# Altium project wether_PCB_new.PrjPcb
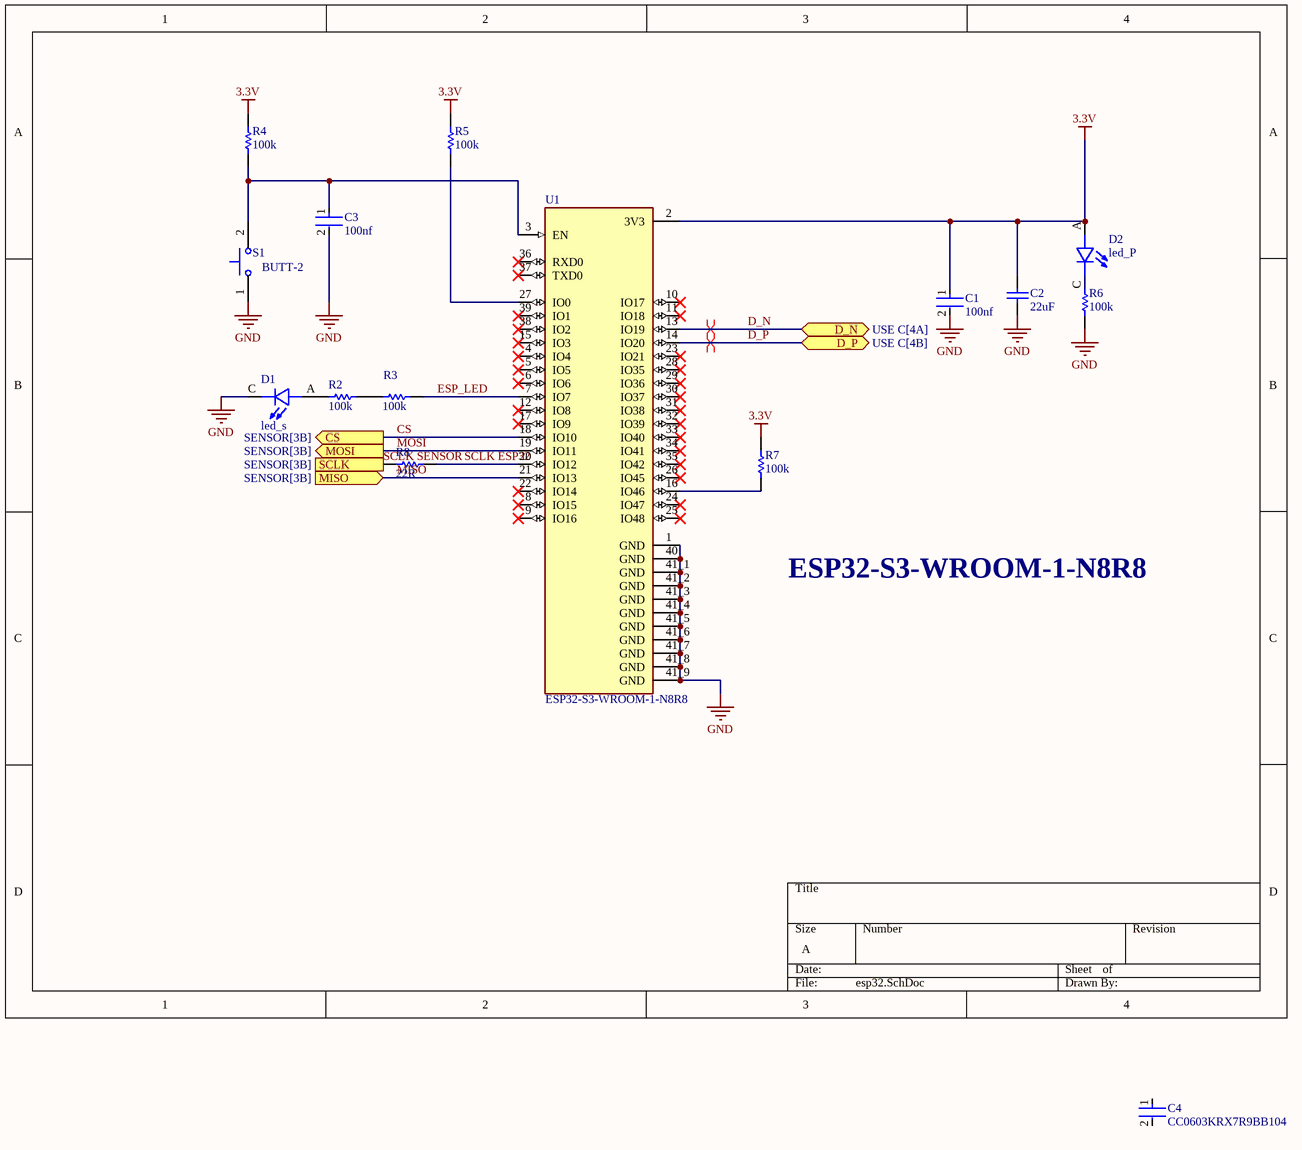
[diagram p0: esp32.SchDoc]
3 sheets, 29 parts. Net scope: flat (ports and power ports of the same name join across sheets).
Board file: wather_project_PCB.PcbDoc
Sheets:
  esp32.SchDoc
  USE C.SchDoc
  SENSOR.SchDoc

## Sheet esp32.SchDoc
size A; SheetNumber: 1; SheetTotal: 3

### Parts
C1  100nf  [FP-CC0603-DA-MFG]
C2  22uF  [CAPC3216X180X55ML20T25]
C3  100nf  [FP-CC0603-DA-MFG]
C4  CC0603KRX7R9BB104  [FP-CC0603-DA-MFG]
D1  led_s  [LEDRD254W57D500H1070]
D2  led_P  [LEDRD254W57D500H1070]
R2  100k  [RESC1005X40X25NL05T10]
R3  100k  [RESC1005X40X25NL05T10]
R4  100k  [RESC1005X40X25NL05T10]
R5  100k  [RESC1005X40X25NL05T10]
R6  100k  [RESC1005X40X25NL05T10]
R7  100k  [RESC1005X40X25NL05T10]
R8  22R  [RESC1608X55X25NL10T15]
S1  BUTT-2  [SW_BUTT-2]
U1  ESP32-S3-WROOM-1-N8R8  [XCVR_ESP32S3WROOM1N8R8]

### Ports
CS (out, see SENSOR[3B]), D_N (bidir, see USE C[4A]), D_P (bidir, see USE C[4B]), MISO (in, see SENSOR[3B]), MOSI (out, see SENSOR[3B]), SCLK (out, see SENSOR[3B])

### Nets
3.3V: C1.1 C2.2 D2.A R4.2 R5.2 R7.2 U1.2(3V3)
GND: C1.2 C2.1 C3.2 D1.C R6.1 S1.1 U1.1(GND) U1.40(GND) U1.41_1(GND) U1.41_2(GND) U1.41_3(GND) U1.41_4(GND) U1.41_5(GND) U1.41_6(GND) U1.41_7(GND) U1.41_8(GND) U1.41_9(GND)
CS: U1.18(IO10) ; port CS
D_N: U1.13(IO19) ; port D_N
D_P: U1.14(IO20) ; port D_P
ESP_LED: R3.1 U1.7(IO7)
MISO: U1.21(IO13) ; port MISO
MOSI: U1.19(IO11) ; port MOSI
SCLK ESP32: R8.2 U1.20(IO12)
SCLK SENSOR: R8.1 ; port SCLK
NetC3_1: C3.1 R4.1 S1.2 U1.3(EN)
NetD1_A: D1.A R2.2
NetD2_C: D2.C R6.2
NetR2_1: R2.1 R3.2
NetR5_1: R5.1 U1.27(IO0)
NetR7_1: R7.1 U1.16(IO46)

Not connected (* = marked no-connect by the designer): C4 1 2; U1 4(IO4)* 5(IO5)* 6(IO6)* 8(IO15)* 9(IO16)* 10(IO17)* 11(IO18)* 12(IO8)* 15(IO3)* 17(IO9)* 22(IO14)* 23(IO21)* 24(IO47)* 25(IO48)* 26(IO45)* 28(IO35)* 29(IO36)* 30(IO37)* 31(IO38)* 32(IO39)* 33(IO40)* 34(IO41)* 35(IO42)* 36(RXD0)* 37(TXD0)* 38(IO2)* 39(IO1)*

### Layout directives
differential pair: D_N, D_P

### Notes on the sheet
- ESP32-S3-WROOM-1-N8R8

### Library data of the parts
C1 C3 = CMP-2100-03601-2: CAP CER 0.1UF 50V X7R 0603; Manufacturer: YAGEO; Manufacturer Part Number: CC0603KRX7R9BB104; Material: Ceramic; Temperature Coefficient: 15%; Tolerance: 0.1; Height: 0.9mm; Voltage: 50 V; ComponentLink2Description: Datasheet; Device Class L2: Capacitors; Temperature Range High: +125°C; Category: Cap; Capacitance: 100 nF; Footprint Url: http://www.yageo.com/exep/pages/download/literatures/UPY-C_GEN_24.pdf; ComponentLink2URL: http://www.yageo.com/documents/recent/UPY-GPHC_X7R_6.3V-to-50V_18.pdf; Package: CC0603-DA; Temperature: -55°C to +125°C; Voltage Rating: 50 V; Temperature Characteristic: X7R; Device Class L1: Passive Components; Temperature Range Low: -55°C; RoHS: TRUE; Automotive: No; Value: 100 nF; Device Class L3: Ceramic Capacitors; Octopart: https://octopart.com/cc0603krx7r9bb104-yageo-42244635; Mouser Description: Multilayer Ceramic Capacitor, CC Series, 0.1 - F, - 10%, X7R, 50 V, 0603 [1608 Metric]; Lead Free: Yes; Digikey Description: CAP CER 0.1UF 50V X7R 0603
C2 = CMP-1662-00010-2: Chip Capacitor, 22 uF, +/- 10%, 25 V, -55 to 85 degC, 1206 (3216 Metric), RoHS, Tape and Reel; PartNumber: GRM31CR61E226KE15L; Voltage Rating: 25 V; Type (Capacitors): X5R; Case\/Package: 1206; PackageDescription: 2-Pin Surface Mount Device, Body 3.2 x 1.6 mm; ComponentLink1URL: http://www.murata.com/; Mount: Surface Mount; Capacitance: 22 uF; PackageReference: 1206; ComponentLink2Description: Datasheet; ComponentLink1Description: Manufacturer URL; Min Operating Temperature: -55 degC; RoHSCompliant: true; Radiation Hardening: No; Package Quantity: 2000; Length: 3.2 mm; Height: 1.6 mm; ComponentLink2URL: http://search.murata.co.jp/Ceramy/image/img/A01X/G101/ENG/GRM31CR61E226KE15-01.pdf; Width: 1.6 mm; Case Code (Imperial): 1206; Max Operating Temperature: 85 degC; Mounting Technology: Surface Mount; Tolerance: 10%; Voltage Rating (DC): 25 V; Pins: 2; Packaging: Tape and Reel; DatasheetVersion: 03/2016; Case Code (Metric): 3216; REACH SVHC: No SVHC
C4 = CMP-2100-03601-2: CAP CER 0.1UF 50V X7R 0603; Manufacturer: YAGEO; Material: Ceramic; Capacitance: 100 nF; Temperature Coefficient: 15%; Tolerance: 0.1; Value: 100 nF; Height: 0.9mm; Voltage: 50 V; ComponentLink2Description: Datasheet; Device Class L2: Capacitors; Temperature Range High: +125°C; Category: Cap; Footprint Url: http://www.yageo.com/exep/pages/download/literatures/UPY-C_GEN_24.pdf; ComponentLink2URL: http://www.yageo.com/documents/recent/UPY-GPHC_X7R_6.3V-to-50V_18.pdf; Package: CC0603-DA; Temperature: -55°C to +125°C; Voltage Rating: 50 V; Temperature Characteristic: X7R; Device Class L1: Passive Components; Temperature Range Low: -55°C; Manufacturer Part Number: CC0603KRX7R9BB104; RoHS: TRUE; Automotive: No; Device Class L3: Ceramic Capacitors; Octopart: https://octopart.com/cc0603krx7r9bb104-yageo-42244635; Mouser Description: Multilayer Ceramic Capacitor, CC Series, 0.1 - F, - 10%, X7R, 50 V, 0603 [1608 Metric]; Lead Free: Yes; Digikey Description: CAP CER 0.1UF 50V X7R 0603
D1 D2 = L08R5000Q1: LED, 5MM, ORANGE; LED / Lamp Size: 5mm / T-1 3/4; LED Colour: Orange; Typ Luminous Intensity: 4.3mcd; Viewing Angle: ...; MF: LED Technology; Value: *; SnapEDA_Link: https://www.snapeda.com/parts/L08R5000Q1/LED+Technology/view-part/?ref=snap; MP: L08R5000Q1; Check_prices: https://www.snapeda.com/parts/L08R5000Q1/LED+Technology/view-part/?ref=eda; Availability: In Stock; Price: None; Package: None
R2-R7 = CMP-2002-07343-1: Part Number: RC0402FR-07100KL; Manufacturer: Yageo / Phycomp
R8 = CMP-1659-00033-1: Chip Resistor, 22 Ohm, +/- 1%, 0.1 W, -55 to 155 degC, 0603 (1608 Metric), RoHS, Tape and Reel; Max Ouput Current: 8 A; Case\Package: SIP; Max Input Voltage: 1.4 V; ComponentLink2URL: http://www.yageo.com/documents/recent/PYu-RC_Group_51_RoHS_L_04.pdf; RoHSCompliant: true; Max Operating Temperature: 100 degC; PackageDescription: 2-Pin Surface Mount Device, Body 1.6 x 0.8 mm; ComponentLink1Description: Manufacturer URL; ComponentLink1URL: http://www.yageo.com/; Length: 18.5 mm; REACH SVHC: Unknown; Pins: 4; DatasheetVersion: Rev. 4, 02/2016; PackageReference: 0603; Output Current: 8 A; Min Operating Temperature: -25 degC; Height: 19.6 mm; Mount: Through Hole; Radiation Hardening: No; ComponentLink2Description: Datasheet; Package Quantity: 200; Packaging: Rail/Tube
S1 = BUTT-2: Tactile Switches MINI PUSH BUTTON SWITCH 2-PIN QTY. 4; MF: Gravitech; SnapEDA_Link: https://www.snapeda.com/parts/BUTT-2/Gravitech/view-part/?ref=snap; Package: None; Value: *; MP: BUTT-2; Check_prices: https://www.snapeda.com/parts/BUTT-2/Gravitech/view-part/?ref=eda
U1 = ESP32-S3-WROOM-1-N8R8: Bluetooth, WiFi 802.11b/g/n, Bluetooth v5.0 Transceiver Module 2.4GHz PCB Trace Surface Mount; MF: Espressif Systems; Package: None; Price: None; Check_prices: https://www.snapeda.com/parts/ESP32-S3-WROOM-1-N8R8/Espressif+Systems/view-part/?ref=eda; Value: *; SnapEDA_Link: https://www.snapeda.com/parts/ESP32-S3-WROOM-1-N8R8/Espressif+Systems/view-part/?ref=snap; MP: ESP32-S3-WROOM-1-N8R8; Availability: In Stock; Purchase-URL: https://pricing.snapeda.com/search?q=ESP32-S3-WROOM-1-N8R8&ref=eda

## Sheet USE C.SchDoc
size A; SheetNumber: 2; SheetTotal: 3
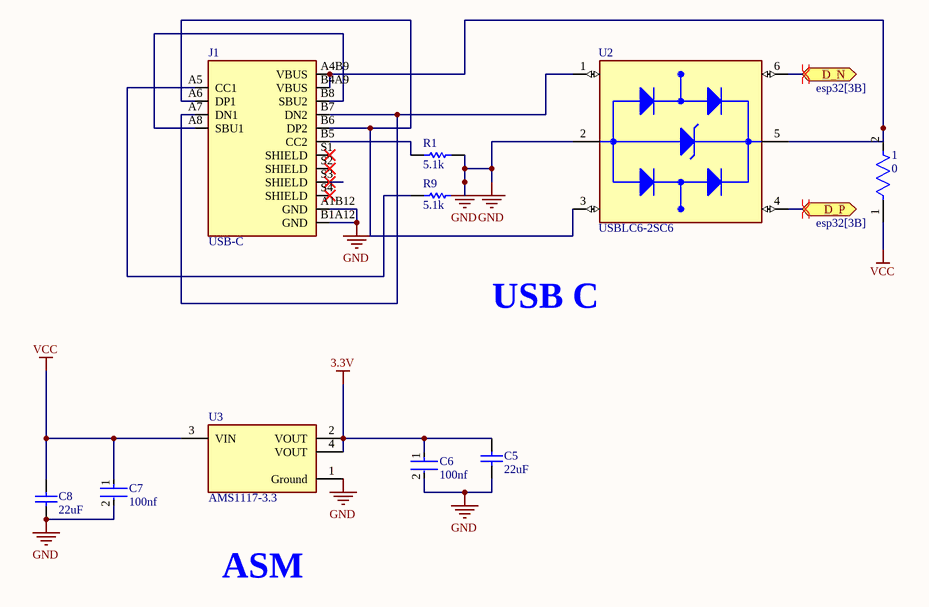
[diagram p1: USE C.SchDoc]

### Parts
1  0  [FP-RC0402-0_4-IPC_A]
C5  22uF  [CAPC3216X180X55ML20T25]
C6  100nf  [FP-CC0603-DA-MFG]
C7  100nf  [FP-CC0603-DA-MFG]
C8  22uF  [CAPC3216X180X55ML20T25]
J1  USB-C  [HRO_TYPE-C-31-M-12]
R1  5.1k  [RESC1005X40X25NL05T10]
R9  5.1k  [RESC1005X40X25NL05T10]
U2  USBLC6-2SC6  [SOT95P280X145-6N]
U3  AMS1117-3.3  [FP-AMS1117-IPC_C]

### Ports
D_N (bidir, see esp32[3B]), D_P (bidir, see esp32[3B])

### Nets
3.3V: C5.2 C6.1 U3.2(VOUT) U3.4(VOUT)
GND: C5.1 C6.2 C7.2 C8.1 J1.A1B12(GND) J1.B1A12(GND) R1.2 R9.2 U2.2(GND) U3.1(Ground)
VCC: 1.1 C7.1 C8.2 U3.3(VIN)
D_N: U2.6(I/O1_OUT) ; port D_N
D_P: U2.4(I/O2_OUT) ; port D_P
Net1_2: 1.2 J1.A4B9(VBUS) J1.B4A9(VBUS) U2.5(VBUS)
NetJ1_A5: J1.A5(CC1) R9.1
NetJ1_A6: J1.A6(DP1) J1.B6(DP2) U2.3(I/O2_IN)
NetJ1_A7: J1.A7(DN1) J1.B7(DN2) U2.1(I/O1_IN)
NetJ1_A8: J1.A8(SBU1) J1.B8(SBU2)
NetJ1_B5: J1.B5(CC2) R1.1

Not connected (* = marked no-connect by the designer): J1 S1(SHIELD)* S2(SHIELD)* S3(SHIELD)* S4(SHIELD)*

### Layout directives
differential pair: D_N, D_P

### Notes on the sheet
- USB C
- ASM

### Library data of the parts
1 = CMP-2002-07342-2: RES SMD 0 OHM JUMPER 1/16W 0402; Resistance: 0R; Temperature Coefficient: 200ppm/°C; Tolerance: 1%; Power Rating: 62.5mW; Voltage Rating: 50V; Max Power Dissipation: 63mW; Features: Moisture Resistant; Length: 1mm; Case Code (Metric): 1005; Series: RC; RoHS Compliant: Yes; Resistor Type: Thick Film; Height: 0.35mm; Min Operating Temperature: -55°C; Case Code (Imperial): 0402; Number of Terminations: 2; Contact Plating: Tin; Case/Package: 0402; Size Code: 0402; Termination: SMD/SMT; Max Operating Temperature: 155°C; Width: 0.5mm; Mount: Surface Mount; Lead Free: Lead Free; Packaging: Tape and Reel; Radiation Hardening: No
C5 C8 = CMP-1662-00010-2: as C2 on sheet esp32; PackageDescription: 2-Pin Surface Mount Device, Body 3.2 x 1.6 mm; ComponentLink1URL: http://www.murata.com/; Mount: Surface Mount; Capacitance: 22 uF; PackageReference: 1206; ComponentLink2Description: Datasheet; ComponentLink1Description: Manufacturer URL; Min Operating Temperature: -55 degC; RoHSCompliant: true; Radiation Hardening: No; Package Quantity: 2000; Length: 3.2 mm; Height: 1.6 mm; ComponentLink2URL: http://search.murata.co.jp/Ceramy/image/img/A01X/G101/ENG/GRM31CR61E226KE15-01.pdf; Width: 1.6 mm; Case Code (Imperial): 1206; Max Operating Temperature: 85 degC; Mounting Technology: Surface Mount; Tolerance: 10%; Voltage Rating (DC): 25 V; Pins: 2; Packaging: Tape and Reel; DatasheetVersion: 03/2016; Case Code (Metric): 3216; REACH SVHC: No SVHC
C6 C7 = CMP-2100-03601-2: as C1 on sheet esp32; Height: 0.9mm; Voltage: 50 V; ComponentLink2Description: Datasheet; Device Class L2: Capacitors; Temperature Range High: +125°C; Category: Cap; Capacitance: 100 nF; Footprint Url: http://www.yageo.com/exep/pages/download/literatures/UPY-C_GEN_24.pdf; ComponentLink2URL: http://www.yageo.com/documents/recent/UPY-GPHC_X7R_6.3V-to-50V_18.pdf; Package: CC0603-DA; Temperature: -55°C to +125°C; Voltage Rating: 50 V; Temperature Characteristic: X7R; Device Class L1: Passive Components; Temperature Range Low: -55°C; RoHS: TRUE; Automotive: No; Value: 100 nF; Device Class L3: Ceramic Capacitors; Octopart: https://octopart.com/cc0603krx7r9bb104-yageo-42244635; Mouser Description: Multilayer Ceramic Capacitor, CC Series, 0.1 - F, - 10%, X7R, 50 V, 0603 [1608 Metric]; Lead Free: Yes; Digikey Description: CAP CER 0.1UF 50V X7R 0603
J1 = USB-C: USB-C (USB TYPE-C) USB 3.2 Gen 2 (USB 3.1 Gen 2, Superspeed + (USB 3.1)) Receptacle Connector 24 Position Surface Mount, Through Hole; MF: Adam Technologies; SnapEDA_Link: https://www.snapeda.com/parts/USB-C/Adam+Tech/view-part/?ref=snap; Package: None; Value: *; MP: USB-C; Check_prices: https://www.snapeda.com/parts/USB-C/Adam+Tech/view-part/?ref=eda
R1 R9 = CMP-2002-07753-1: Part Number: RC0402FR-075K1L; Manufacturer: Yageo / Phycomp
U2 = USBLC6-2SC6: 17V Clamp 5A (8/20Âµs) Ipp Tvs Diode Surface Mount SOT-23-6; MF: STMicroelectronics; Value: *; SnapEDA_Link: https://www.snapeda.com/parts/USBLC6-2SC6/STMicroelectronics/view-part/?ref=snap; Check_prices: https://www.snapeda.com/parts/USBLC6-2SC6/STMicroelectronics/view-part/?ref=eda; Purchase-URL: https://pricing.snapeda.com/search/part/USBLC6-2SC6/?ref=eda; Price: None; Availability: In Stock; Package: SOT-23-6 STMicroelectronics; MP: USBLC6-2SC6
U3 = CMP-209535-000001-1: LDO Voltage Regulators 1A, 3.3V; Manufacturer: Advanced Monolithic Systems; Dropout Voltage: 1.1V; Output Type: Fixed; Nominal Supply Current: 5mA; Max Power Dissipation: 1.2W; Max Supply Voltage: 15V; Number Of Outputs: 1; Standoff Height: 0.64mm; Max Junction Temp: +125°C; Height: 1.8mm; Package: AMS1117; Device Class L2: Power Management ICs; ComponentLink2Description: Datasheet; ComponentLink2URL: http://www.advanced-monolithic.com/pdf/ds1117.pdf; Category: IC; RoHS: TRUE; Automotive: No; Device Class L1: Integrated Circuits (ICs); Output Current: 1A; Device Class L3: Voltage Regulators - Linear; Temperature: -40°C to +125°C; Output Voltage: 3.3V; Manufacturer Part Number: AMS1117-3.3; Temperature Range Low: -40°C; Octopart: https://octopart.com/ams1117-3.3-advanced+monolithic+systems-25899300; Lead Free: Yes; Ipc Land Pattern Name: SOT229P700X180-4; Temperature Range High: +125°C

## Sheet SENSOR.SchDoc
size A; SheetNumber: 3; SheetTotal: 3
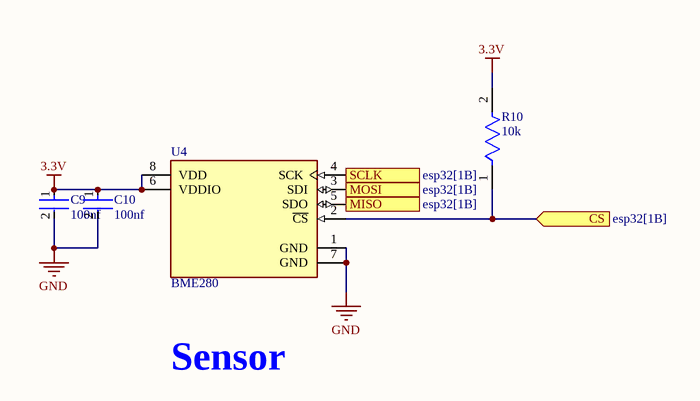
[diagram p2: SENSOR.SchDoc]

### Parts
C9  100nf  [FP-CC0603-DA-MFG]
C10  100nf  [FP-CC0603-DA-MFG]
R10  10k  [FP-RC0603-0_55-IPC_C]
U4  BME280  [FP-BME280-MFG]

### Ports
CS (in, see esp32[1B]), MISO (out, see esp32[1B]), MOSI (in, see esp32[1B]), SCLK (in, see esp32[1B])

### Nets
3.3V: C9.1 C10.1 R10.2 U4.6(VDDIO) U4.8(VDD)
GND: C9.2 C10.2 U4.1(GND) U4.7(GND)
CS: R10.1 U4.2(~{CS}) ; port CS
MISO: U4.5(SDO) ; port MISO
MOSI: U4.3(SDI) ; port MOSI
SCLK SENSOR: U4.4(SCK) ; port SCLK

### Notes on the sheet
- Sensor

### Library data of the parts
C9 C10 = CMP-2100-03601-2: as C1 on sheet esp32; Height: 0.9mm; Voltage: 50 V; ComponentLink2Description: Datasheet; Device Class L2: Capacitors; Temperature Range High: +125°C; Category: Cap; Capacitance: 100 nF; Footprint Url: http://www.yageo.com/exep/pages/download/literatures/UPY-C_GEN_24.pdf; ComponentLink2URL: http://www.yageo.com/documents/recent/UPY-GPHC_X7R_6.3V-to-50V_18.pdf; Package: CC0603-DA; Temperature: -55°C to +125°C; Voltage Rating: 50 V; Temperature Characteristic: X7R; Device Class L1: Passive Components; Temperature Range Low: -55°C; RoHS: TRUE; Automotive: No; Value: 100 nF; Device Class L3: Ceramic Capacitors; Octopart: https://octopart.com/cc0603krx7r9bb104-yageo-42244635; Mouser Description: Multilayer Ceramic Capacitor, CC Series, 0.1 - F, - 10%, X7R, 50 V, 0603 [1608 Metric]; Lead Free: Yes; Digikey Description: CAP CER 0.1UF 50V X7R 0603
R10 = CMP-2100-03664-2: RES 10K OHM 1% 1/10W 0603; Voltage Rating: 75V; Voltage Rating (DC): 50V; Resistance: 10kR; Power Rating: 100mW; Temperature Coefficient: 100ppm/°C; Depth: 0.8mm; Termination: SMD/SMT; Resistor Type: Thick Film; Series: RC; Construction: Rectangular; Features: Moisture Resistant; Packaging: Tape and Reel; Min Operating Temperature: -55°C; Number of Terminations: 2; Lead Pitch: 0.3mm; RoHS Compliant: Yes; Case/Package: 0603; Resistance Tolerance: 1%; Military Standard: Not; Weight: 7.1E-05oz; Number of Pins: 2; Tolerance: 1%; Length: 1.6mm; Case Code (Imperial): 0603; Lead Free: Lead Free; Width: 0.8mm; Max Power Dissipation: 100mW; Height: 0.45mm; Max Operating Temperature: 155°C; Case Code (Metric): 1608; Size Code: 0603
U4 = CMP-2000-05073-3: SENSOR PRESSURE HUMIDITY TEMP; Sensor Type: Temperature; Accuracy: 3%; Response Time: 1s; Output Type: SPI; Min Operating Temperature: -40°C; Max Operating Temperature: 85°C; Case/Package: LGA; Packaging: Cut Tape; Mount: Surface Mount; Lead Free: Lead Free; Number of Pins: 8

## Nets that join several sheets
3.3V: esp32 (7 pins), USE C (C5.2 C6.1 U3.2 U3.4), SENSOR (5 pins)
GND: esp32 (17 pins), USE C (10 pins), SENSOR (C9.2 C10.2 U4.1 U4.7)
CS: esp32 (U1.18), SENSOR (R10.1 U4.2)
D_N: esp32 (U1.13), USE C (U2.6)
D_P: esp32 (U1.14), USE C (U2.4)
MISO: esp32 (U1.21), SENSOR (U4.5)
MOSI: esp32 (U1.19), SENSOR (U4.3)
SCLK SENSOR: esp32 (R8.1), SENSOR (U4.4)